# EasyEDA Pro project pcb.eprj, board PCB
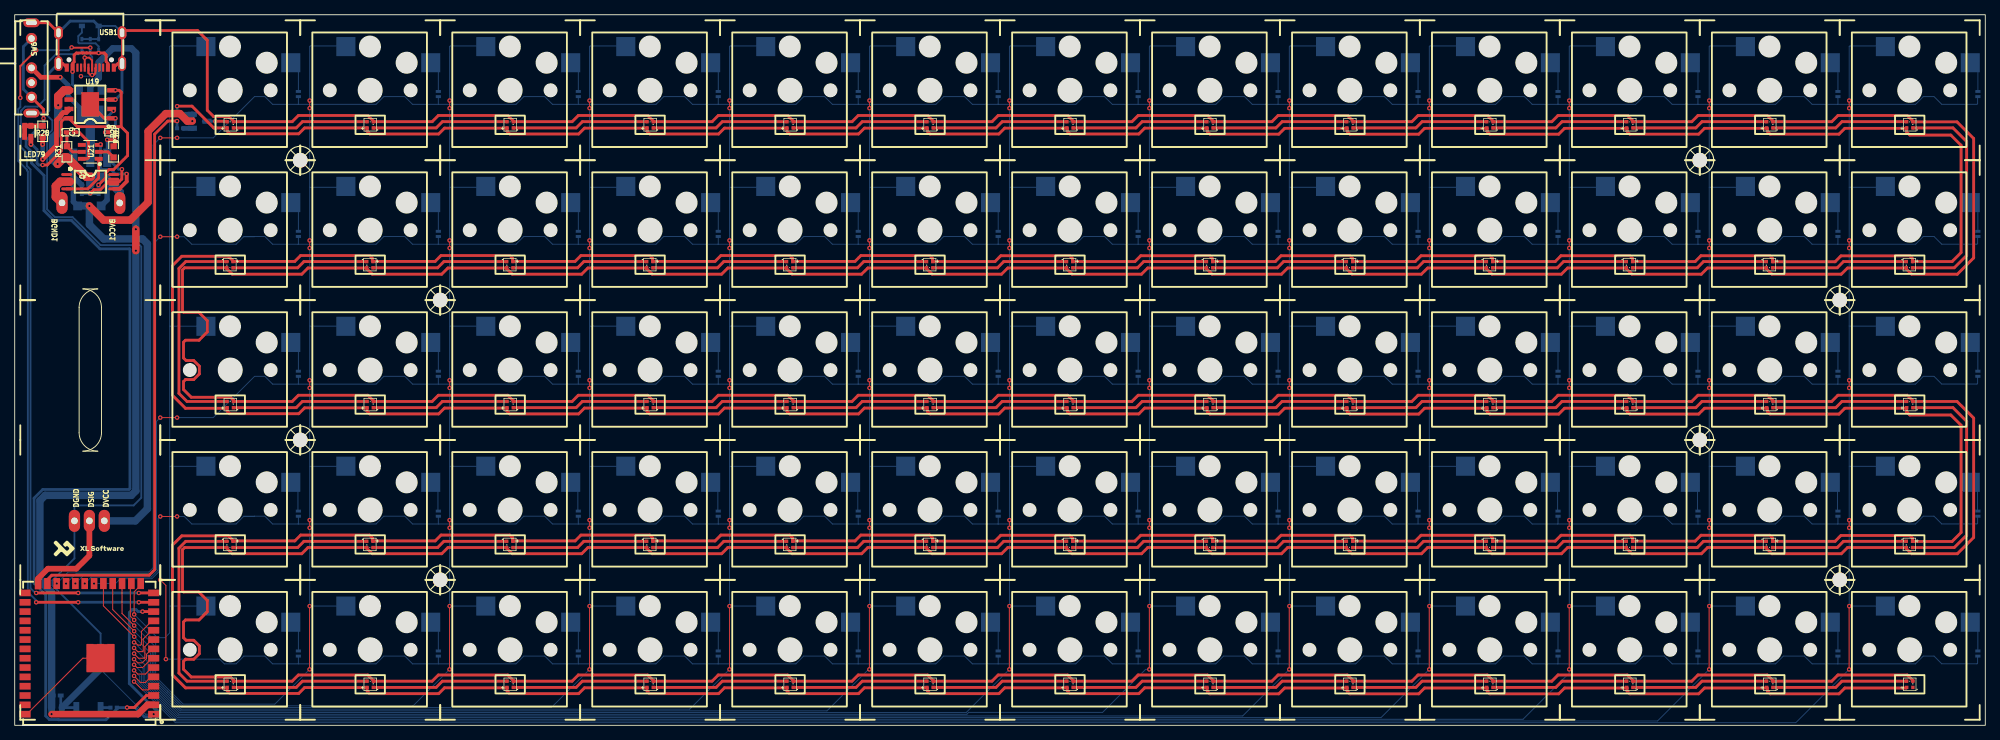
[diagram p6: board, top side]
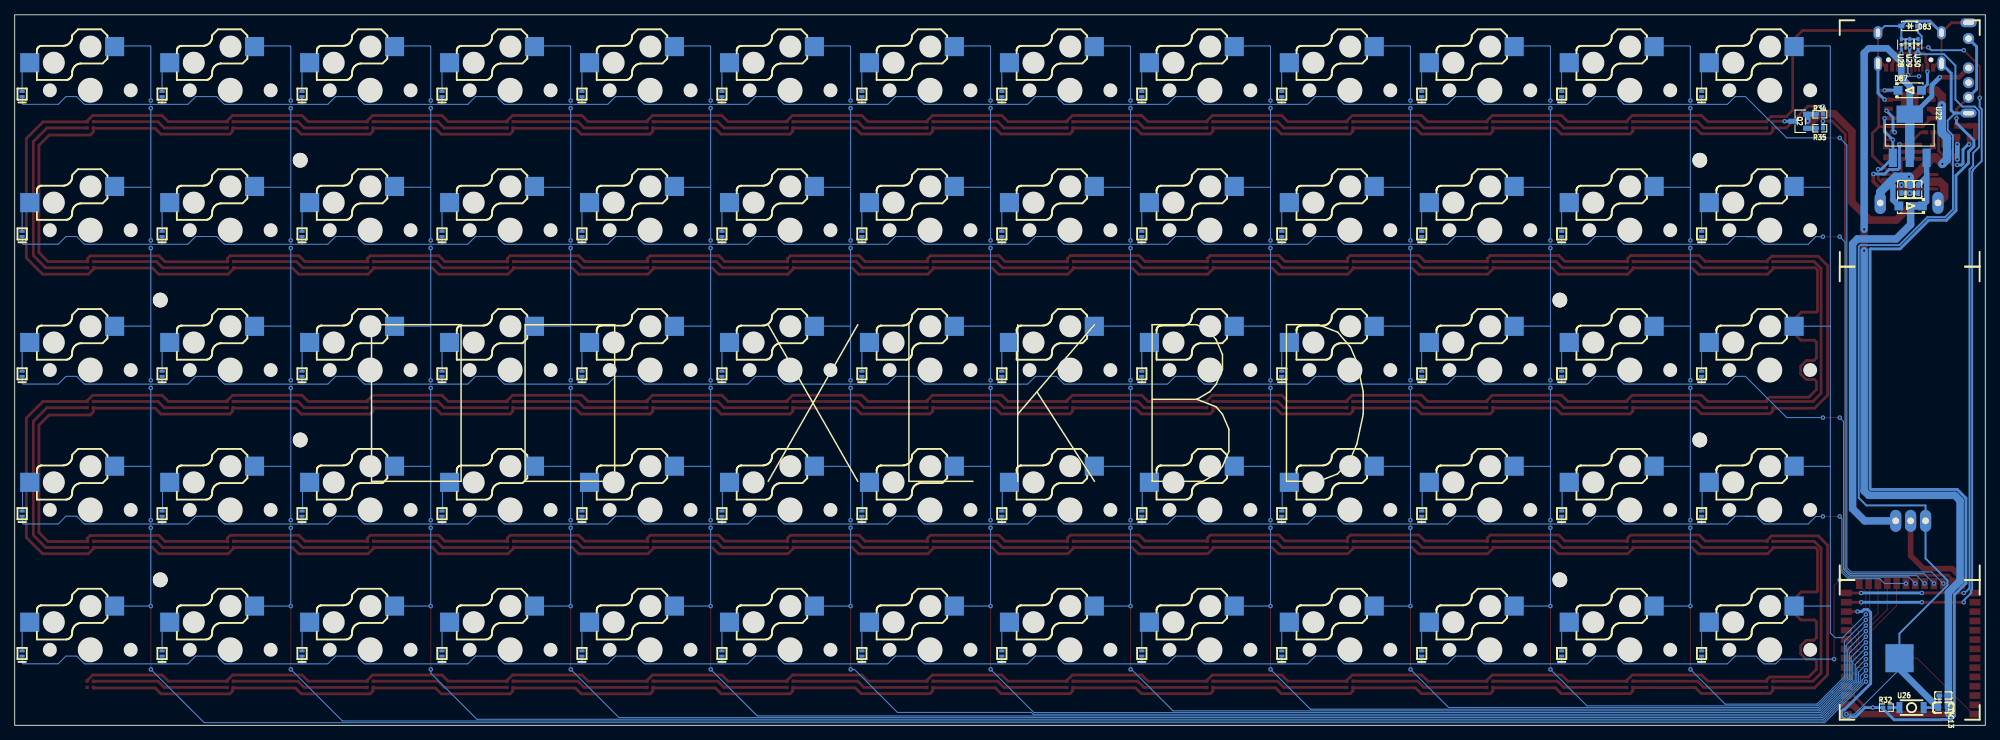
[diagram p7: board, bottom side, seen from below]

Outline 268.22 x 96.77 mm; copper layers: Top Layer, Bottom Layer. Coordinates in mm from the lower left corner of the outline.
Outline path: rectangle 0,96.77 268.22,0
Stack: Top Layer 0.035mm / Dielectric1 1.51mm FR4 er 4.5 / Bottom Layer 0.035mm

## Design rules (mm)
template: JLCPCB Capability(Two Layers Board)
spacing copperThickness1oz (default): track to track 0.102, other pairs 0.152 to 0.3
spacing copperThickness2oz: track to track 0.203, other pairs 0.152 to 0.3
track width copperThickness1oz (default): min 0.127, default 0.254, max 2.54
track width copperThickness2oz: min 0.203, default 0.254, max 2.54
differential pair differentialPair (default): width min 0.127, default 0.254, max 2.54; gap min 0.152, default 0.152
via viaSize (default): diameter min 0.5, default 0.61, max 10; hole min 0.3, default 0.305, max 6.3
net 5V uses copperThickness2oz

## Placement (name value [footprint] x y rotation side)
BGND1  -  [PADX1X]  6.44 71.16 270 bottom
BVCC1  -  [PADX1X]  14.3 71.14 270 bottom
C8  100nF  [C0402]  11.43 73.02 90 bottom
C9  100nF  [C0402]  7.62 80.77 180 top
C10  10uF  [C0402]  10.29 73.02 90 bottom
C11  10uF  [C0402]  9.14 73.02 90 bottom
C13  10uF  [C0603]  5.72 2.41 0 bottom
C14  100nF  [C0402]  5.72 4.06 0 bottom
D1  RB161QS-40T18R  [X2-DFN1006-2_L1.0-W0.6-P0.65-RD]  38.61 85.98 90 bottom
D2  RB161QS-40T18R  [X2-DFN1006-2_L1.0-W0.6-P0.65-RD]  57.66 85.98 90 bottom
D3  RB161QS-40T18R  [X2-DFN1006-2_L1.0-W0.6-P0.65-RD]  76.71 85.98 90 bottom
D4  RB161QS-40T18R  [X2-DFN1006-2_L1.0-W0.6-P0.65-RD]  95.76 85.98 90 bottom
D5  RB161QS-40T18R  [X2-DFN1006-2_L1.0-W0.6-P0.65-RD]  114.81 85.98 90 bottom
D6  RB161QS-40T18R  [X2-DFN1006-2_L1.0-W0.6-P0.65-RD]  133.86 85.98 90 bottom
D7  RB161QS-40T18R  [X2-DFN1006-2_L1.0-W0.6-P0.65-RD]  152.91 85.98 90 bottom
D8  RB161QS-40T18R  [X2-DFN1006-2_L1.0-W0.6-P0.65-RD]  171.96 85.98 90 bottom
D9  RB161QS-40T18R  [X2-DFN1006-2_L1.0-W0.6-P0.65-RD]  191.01 85.98 90 bottom
D10  RB161QS-40T18R  [X2-DFN1006-2_L1.0-W0.6-P0.65-RD]  210.06 85.98 90 bottom
D11  RB161QS-40T18R  [X2-DFN1006-2_L1.0-W0.6-P0.65-RD]  229.11 85.98 90 bottom
D12  RB161QS-40T18R  [X2-DFN1006-2_L1.0-W0.6-P0.65-RD]  248.16 85.98 90 bottom
D13  RB161QS-40T18R  [X2-DFN1006-2_L1.0-W0.6-P0.65-RD]  267.21 85.98 90 bottom
D14  RB161QS-40T18R  [X2-DFN1006-2_L1.0-W0.6-P0.65-RD]  38.61 66.93 90 bottom
D15  RB161QS-40T18R  [X2-DFN1006-2_L1.0-W0.6-P0.65-RD]  57.66 66.93 90 bottom
D16  RB161QS-40T18R  [X2-DFN1006-2_L1.0-W0.6-P0.65-RD]  76.71 66.93 90 bottom
D17  RB161QS-40T18R  [X2-DFN1006-2_L1.0-W0.6-P0.65-RD]  95.76 66.93 90 bottom
D18  RB161QS-40T18R  [X2-DFN1006-2_L1.0-W0.6-P0.65-RD]  114.81 66.93 90 bottom
D19  RB161QS-40T18R  [X2-DFN1006-2_L1.0-W0.6-P0.65-RD]  133.86 66.93 90 bottom
D20  RB161QS-40T18R  [X2-DFN1006-2_L1.0-W0.6-P0.65-RD]  152.91 66.93 90 bottom
D21  RB161QS-40T18R  [X2-DFN1006-2_L1.0-W0.6-P0.65-RD]  171.96 66.93 90 bottom
D22  RB161QS-40T18R  [X2-DFN1006-2_L1.0-W0.6-P0.65-RD]  191.01 66.93 90 bottom
D23  RB161QS-40T18R  [X2-DFN1006-2_L1.0-W0.6-P0.65-RD]  210.06 66.93 90 bottom
D24  RB161QS-40T18R  [X2-DFN1006-2_L1.0-W0.6-P0.65-RD]  229.11 66.93 90 bottom
D25  RB161QS-40T18R  [X2-DFN1006-2_L1.0-W0.6-P0.65-RD]  248.16 66.93 90 bottom
D26  RB161QS-40T18R  [X2-DFN1006-2_L1.0-W0.6-P0.65-RD]  267.21 66.93 90 bottom
D27  RB161QS-40T18R  [X2-DFN1006-2_L1.0-W0.6-P0.65-RD]  38.61 47.88 90 bottom
D28  RB161QS-40T18R  [X2-DFN1006-2_L1.0-W0.6-P0.65-RD]  57.66 47.88 90 bottom
D29  RB161QS-40T18R  [X2-DFN1006-2_L1.0-W0.6-P0.65-RD]  76.71 47.88 90 bottom
D30  RB161QS-40T18R  [X2-DFN1006-2_L1.0-W0.6-P0.65-RD]  95.76 47.88 90 bottom
D31  RB161QS-40T18R  [X2-DFN1006-2_L1.0-W0.6-P0.65-RD]  114.81 47.88 90 bottom
D32  RB161QS-40T18R  [X2-DFN1006-2_L1.0-W0.6-P0.65-RD]  133.86 47.88 90 bottom
D33  RB161QS-40T18R  [X2-DFN1006-2_L1.0-W0.6-P0.65-RD]  152.91 47.88 90 bottom
D34  RB161QS-40T18R  [X2-DFN1006-2_L1.0-W0.6-P0.65-RD]  171.96 47.88 90 bottom
D35  RB161QS-40T18R  [X2-DFN1006-2_L1.0-W0.6-P0.65-RD]  191.01 47.88 90 bottom
D36  RB161QS-40T18R  [X2-DFN1006-2_L1.0-W0.6-P0.65-RD]  210.06 47.88 90 bottom
D37  RB161QS-40T18R  [X2-DFN1006-2_L1.0-W0.6-P0.65-RD]  229.11 47.88 90 bottom
D38  RB161QS-40T18R  [X2-DFN1006-2_L1.0-W0.6-P0.65-RD]  248.16 47.88 90 bottom
D39  RB161QS-40T18R  [X2-DFN1006-2_L1.0-W0.6-P0.65-RD]  267.21 47.88 90 bottom
D53  RB161QS-40T18R  [X2-DFN1006-2_L1.0-W0.6-P0.65-RD]  38.61 28.83 90 bottom
D54  RB161QS-40T18R  [X2-DFN1006-2_L1.0-W0.6-P0.65-RD]  57.66 28.83 90 bottom
D55  RB161QS-40T18R  [X2-DFN1006-2_L1.0-W0.6-P0.65-RD]  76.71 28.83 90 bottom
D56  RB161QS-40T18R  [X2-DFN1006-2_L1.0-W0.6-P0.65-RD]  95.76 28.83 90 bottom
D57  RB161QS-40T18R  [X2-DFN1006-2_L1.0-W0.6-P0.65-RD]  114.81 28.83 90 bottom
D58  RB161QS-40T18R  [X2-DFN1006-2_L1.0-W0.6-P0.65-RD]  133.86 28.83 90 bottom
D59  RB161QS-40T18R  [X2-DFN1006-2_L1.0-W0.6-P0.65-RD]  152.91 28.83 90 bottom
D60  RB161QS-40T18R  [X2-DFN1006-2_L1.0-W0.6-P0.65-RD]  171.96 28.83 90 bottom
D61  RB161QS-40T18R  [X2-DFN1006-2_L1.0-W0.6-P0.65-RD]  191.01 28.83 90 bottom
D62  RB161QS-40T18R  [X2-DFN1006-2_L1.0-W0.6-P0.65-RD]  210.06 28.83 90 bottom
D63  RB161QS-40T18R  [X2-DFN1006-2_L1.0-W0.6-P0.65-RD]  229.11 28.83 90 bottom
D64  RB161QS-40T18R  [X2-DFN1006-2_L1.0-W0.6-P0.65-RD]  248.16 28.83 90 bottom
D65  RB161QS-40T18R  [X2-DFN1006-2_L1.0-W0.6-P0.65-RD]  267.21 28.83 90 bottom
D66  RB161QS-40T18R  [X2-DFN1006-2_L1.0-W0.6-P0.65-RD]  38.61 9.78 90 bottom
D67  RB161QS-40T18R  [X2-DFN1006-2_L1.0-W0.6-P0.65-RD]  57.66 9.78 90 bottom
D68  RB161QS-40T18R  [X2-DFN1006-2_L1.0-W0.6-P0.65-RD]  76.71 9.78 90 bottom
D69  RB161QS-40T18R  [X2-DFN1006-2_L1.0-W0.6-P0.65-RD]  95.76 9.78 90 bottom
D70  RB161QS-40T18R  [X2-DFN1006-2_L1.0-W0.6-P0.65-RD]  114.81 9.78 90 bottom
D71  RB161QS-40T18R  [X2-DFN1006-2_L1.0-W0.6-P0.65-RD]  133.86 9.78 90 bottom
D72  RB161QS-40T18R  [X2-DFN1006-2_L1.0-W0.6-P0.65-RD]  152.91 9.78 90 bottom
D73  RB161QS-40T18R  [X2-DFN1006-2_L1.0-W0.6-P0.65-RD]  171.96 9.78 90 bottom
D74  RB161QS-40T18R  [X2-DFN1006-2_L1.0-W0.6-P0.65-RD]  191.01 9.78 90 bottom
D75  RB161QS-40T18R  [X2-DFN1006-2_L1.0-W0.6-P0.65-RD]  210.06 9.78 90 bottom
D76  RB161QS-40T18R  [X2-DFN1006-2_L1.0-W0.6-P0.65-RD]  229.11 9.78 90 bottom
D77  RB161QS-40T18R  [X2-DFN1006-2_L1.0-W0.6-P0.65-RD]  248.16 9.78 90 bottom
D78  RB161QS-40T18R  [X2-DFN1006-2_L1.0-W0.6-P0.65-RD]  267.21 9.78 90 bottom
D82  1N4007 A7  [SOD-123FL_L2.8-W1.8-LS3.7-RD]  10.16 70.74 0 bottom
D83  BAT760-7  [SOD-323_L1.7-W1.3-LS2.6-RD]  10.29 95.25 0 bottom
D87  1N4007 A7  [SOD-123FL_L2.8-W1.8-LS3.7-RD]  10.29 86.49 180 bottom
DGND  -  [PADX1X]  8.13 27.85 90 top
DSIG  -  [PADX1X]  10.16 27.85 90 top
DVCC  -  [PADX1X]  12.2 27.85 90 top
LED1  XL-1010RGBC-WS2812B  [LED-SMD_4P-L1.0-W1.0-TL_XL-1010RGBC-WS2812B]  257.94 5.59 180 top
LED2  XL-1010RGBC-WS2812B  [LED-SMD_4P-L1.0-W1.0-TL_XL-1010RGBC-WS2812B]  238.89 5.59 180 top
LED3  XL-1010RGBC-WS2812B  [LED-SMD_4P-L1.0-W1.0-TL_XL-1010RGBC-WS2812B]  219.84 5.59 180 top
LED4  XL-1010RGBC-WS2812B  [LED-SMD_4P-L1.0-W1.0-TL_XL-1010RGBC-WS2812B]  200.79 5.59 180 top
LED5  XL-1010RGBC-WS2812B  [LED-SMD_4P-L1.0-W1.0-TL_XL-1010RGBC-WS2812B]  181.74 5.59 180 top
LED6  XL-1010RGBC-WS2812B  [LED-SMD_4P-L1.0-W1.0-TL_XL-1010RGBC-WS2812B]  162.69 5.59 180 top
LED7  XL-1010RGBC-WS2812B  [LED-SMD_4P-L1.0-W1.0-TL_XL-1010RGBC-WS2812B]  143.64 5.59 180 top
LED8  XL-1010RGBC-WS2812B  [LED-SMD_4P-L1.0-W1.0-TL_XL-1010RGBC-WS2812B]  124.59 5.59 180 top
LED9  XL-1010RGBC-WS2812B  [LED-SMD_4P-L1.0-W1.0-TL_XL-1010RGBC-WS2812B]  105.54 5.59 180 top
LED10  XL-1010RGBC-WS2812B  [LED-SMD_4P-L1.0-W1.0-TL_XL-1010RGBC-WS2812B]  86.49 5.59 180 top
LED11  XL-1010RGBC-WS2812B  [LED-SMD_4P-L1.0-W1.0-TL_XL-1010RGBC-WS2812B]  67.44 5.59 180 top
LED12  XL-1010RGBC-WS2812B  [LED-SMD_4P-L1.0-W1.0-TL_XL-1010RGBC-WS2812B]  48.39 5.59 180 top
LED13  XL-1010RGBC-WS2812B  [LED-SMD_4P-L1.0-W1.0-TL_XL-1010RGBC-WS2812B]  29.34 5.59 180 top
LED14  XL-1010RGBC-WS2812B  [LED-SMD_4P-L1.0-W1.0-TL_XL-1010RGBC-WS2812B]  29.29 24.64 0 top
LED15  XL-1010RGBC-WS2812B  [LED-SMD_4P-L1.0-W1.0-TL_XL-1010RGBC-WS2812B]  48.34 24.64 0 top
LED16  XL-1010RGBC-WS2812B  [LED-SMD_4P-L1.0-W1.0-TL_XL-1010RGBC-WS2812B]  67.39 24.64 0 top
LED17  XL-1010RGBC-WS2812B  [LED-SMD_4P-L1.0-W1.0-TL_XL-1010RGBC-WS2812B]  86.44 24.64 0 top
LED18  XL-1010RGBC-WS2812B  [LED-SMD_4P-L1.0-W1.0-TL_XL-1010RGBC-WS2812B]  105.49 24.64 0 top
LED19  XL-1010RGBC-WS2812B  [LED-SMD_4P-L1.0-W1.0-TL_XL-1010RGBC-WS2812B]  124.54 24.64 0 top
LED20  XL-1010RGBC-WS2812B  [LED-SMD_4P-L1.0-W1.0-TL_XL-1010RGBC-WS2812B]  143.59 24.64 0 top
LED21  XL-1010RGBC-WS2812B  [LED-SMD_4P-L1.0-W1.0-TL_XL-1010RGBC-WS2812B]  162.64 24.64 0 top
LED22  XL-1010RGBC-WS2812B  [LED-SMD_4P-L1.0-W1.0-TL_XL-1010RGBC-WS2812B]  181.69 24.64 0 top
LED23  XL-1010RGBC-WS2812B  [LED-SMD_4P-L1.0-W1.0-TL_XL-1010RGBC-WS2812B]  200.74 24.64 0 top
LED24  XL-1010RGBC-WS2812B  [LED-SMD_4P-L1.0-W1.0-TL_XL-1010RGBC-WS2812B]  219.79 24.64 0 top
LED25  XL-1010RGBC-WS2812B  [LED-SMD_4P-L1.0-W1.0-TL_XL-1010RGBC-WS2812B]  238.84 24.64 0 top
LED26  XL-1010RGBC-WS2812B  [LED-SMD_4P-L1.0-W1.0-TL_XL-1010RGBC-WS2812B]  257.89 24.64 0 top
LED27  XL-1010RGBC-WS2812B  [LED-SMD_4P-L1.0-W1.0-TL_XL-1010RGBC-WS2812B]  257.94 43.69 180 top
LED28  XL-1010RGBC-WS2812B  [LED-SMD_4P-L1.0-W1.0-TL_XL-1010RGBC-WS2812B]  238.89 43.69 180 top
LED29  XL-1010RGBC-WS2812B  [LED-SMD_4P-L1.0-W1.0-TL_XL-1010RGBC-WS2812B]  219.84 43.69 180 top
LED30  XL-1010RGBC-WS2812B  [LED-SMD_4P-L1.0-W1.0-TL_XL-1010RGBC-WS2812B]  200.79 43.69 180 top
LED31  XL-1010RGBC-WS2812B  [LED-SMD_4P-L1.0-W1.0-TL_XL-1010RGBC-WS2812B]  181.74 43.69 180 top
LED32  XL-1010RGBC-WS2812B  [LED-SMD_4P-L1.0-W1.0-TL_XL-1010RGBC-WS2812B]  162.69 43.69 180 top
LED33  XL-1010RGBC-WS2812B  [LED-SMD_4P-L1.0-W1.0-TL_XL-1010RGBC-WS2812B]  143.64 43.69 180 top
LED34  XL-1010RGBC-WS2812B  [LED-SMD_4P-L1.0-W1.0-TL_XL-1010RGBC-WS2812B]  124.59 43.69 180 top
LED35  XL-1010RGBC-WS2812B  [LED-SMD_4P-L1.0-W1.0-TL_XL-1010RGBC-WS2812B]  105.54 43.69 180 top
LED36  XL-1010RGBC-WS2812B  [LED-SMD_4P-L1.0-W1.0-TL_XL-1010RGBC-WS2812B]  86.49 43.69 180 top
LED37  XL-1010RGBC-WS2812B  [LED-SMD_4P-L1.0-W1.0-TL_XL-1010RGBC-WS2812B]  67.44 43.69 180 top
LED38  XL-1010RGBC-WS2812B  [LED-SMD_4P-L1.0-W1.0-TL_XL-1010RGBC-WS2812B]  48.39 43.69 180 top
LED39  XL-1010RGBC-WS2812B  [LED-SMD_4P-L1.0-W1.0-TL_XL-1010RGBC-WS2812B]  29.34 43.69 180 top
LED53  XL-1010RGBC-WS2812B  [LED-SMD_4P-L1.0-W1.0-TL_XL-1010RGBC-WS2812B]  29.29 62.74 0 top
LED54  XL-1010RGBC-WS2812B  [LED-SMD_4P-L1.0-W1.0-TL_XL-1010RGBC-WS2812B]  48.34 62.74 0 top
LED55  XL-1010RGBC-WS2812B  [LED-SMD_4P-L1.0-W1.0-TL_XL-1010RGBC-WS2812B]  67.39 62.74 0 top
LED56  XL-1010RGBC-WS2812B  [LED-SMD_4P-L1.0-W1.0-TL_XL-1010RGBC-WS2812B]  86.44 62.74 0 top
LED57  XL-1010RGBC-WS2812B  [LED-SMD_4P-L1.0-W1.0-TL_XL-1010RGBC-WS2812B]  105.49 62.74 0 top
LED58  XL-1010RGBC-WS2812B  [LED-SMD_4P-L1.0-W1.0-TL_XL-1010RGBC-WS2812B]  124.54 62.74 0 top
LED59  XL-1010RGBC-WS2812B  [LED-SMD_4P-L1.0-W1.0-TL_XL-1010RGBC-WS2812B]  143.59 62.74 0 top
LED60  XL-1010RGBC-WS2812B  [LED-SMD_4P-L1.0-W1.0-TL_XL-1010RGBC-WS2812B]  162.64 62.74 0 top
LED61  XL-1010RGBC-WS2812B  [LED-SMD_4P-L1.0-W1.0-TL_XL-1010RGBC-WS2812B]  181.69 62.74 0 top
LED62  XL-1010RGBC-WS2812B  [LED-SMD_4P-L1.0-W1.0-TL_XL-1010RGBC-WS2812B]  200.74 62.74 0 top
LED63  XL-1010RGBC-WS2812B  [LED-SMD_4P-L1.0-W1.0-TL_XL-1010RGBC-WS2812B]  219.79 62.74 0 top
LED64  XL-1010RGBC-WS2812B  [LED-SMD_4P-L1.0-W1.0-TL_XL-1010RGBC-WS2812B]  238.84 62.74 0 top
LED65  XL-1010RGBC-WS2812B  [LED-SMD_4P-L1.0-W1.0-TL_XL-1010RGBC-WS2812B]  257.89 62.74 0 top
LED66  XL-1010RGBC-WS2812B  [LED-SMD_4P-L1.0-W1.0-TL_XL-1010RGBC-WS2812B]  257.94 81.79 180 top
LED67  XL-1010RGBC-WS2812B  [LED-SMD_4P-L1.0-W1.0-TL_XL-1010RGBC-WS2812B]  238.89 81.79 180 top
LED68  XL-1010RGBC-WS2812B  [LED-SMD_4P-L1.0-W1.0-TL_XL-1010RGBC-WS2812B]  219.84 81.79 180 top
LED69  XL-1010RGBC-WS2812B  [LED-SMD_4P-L1.0-W1.0-TL_XL-1010RGBC-WS2812B]  200.79 81.79 180 top
LED70  XL-1010RGBC-WS2812B  [LED-SMD_4P-L1.0-W1.0-TL_XL-1010RGBC-WS2812B]  181.74 81.79 180 top
LED71  XL-1010RGBC-WS2812B  [LED-SMD_4P-L1.0-W1.0-TL_XL-1010RGBC-WS2812B]  162.69 81.79 180 top
LED72  XL-1010RGBC-WS2812B  [LED-SMD_4P-L1.0-W1.0-TL_XL-1010RGBC-WS2812B]  143.64 81.79 180 top
LED73  XL-1010RGBC-WS2812B  [LED-SMD_4P-L1.0-W1.0-TL_XL-1010RGBC-WS2812B]  124.59 81.79 180 top
LED74  XL-1010RGBC-WS2812B  [LED-SMD_4P-L1.0-W1.0-TL_XL-1010RGBC-WS2812B]  105.54 81.79 180 top
LED75  XL-1010RGBC-WS2812B  [LED-SMD_4P-L1.0-W1.0-TL_XL-1010RGBC-WS2812B]  86.49 81.79 180 top
LED76  XL-1010RGBC-WS2812B  [LED-SMD_4P-L1.0-W1.0-TL_XL-1010RGBC-WS2812B]  67.44 81.79 180 top
LED77  XL-1010RGBC-WS2812B  [LED-SMD_4P-L1.0-W1.0-TL_XL-1010RGBC-WS2812B]  48.39 81.79 180 top
LED78  XL-1010RGBC-WS2812B  [LED-SMD_4P-L1.0-W1.0-TL_XL-1010RGBC-WS2812B]  29.34 81.79 180 top
LED79  XL-1615RGBC-RF  [LED-ARRAY-SMD_4P-L1.6-W1.5-BR_XL-1615RGBC-RF]  1.78 80.9 270 top
NOREF  -  [Pad_e6664]  11.69 9.14 0 top
Q1  FS8205A  [TSSOP-8_L4.4-W3.0-P0.65-LS6.4-BL-2]  10.29 74.04 270 top
Q2  S8550  [SOT-23-3_L2.9-W1.3-P1.90-LS2.4-BR]  25.18 82.27 180 bottom
R28  1kΩ  [R0603]  3.81 80.9 90 top
R29  1.2kΩ  [R0402]  13.21 80.77 180 top
R30  1kΩ  [R0603]  13.46 78.1 90 top
R31  1kΩ  [R0603]  7.11 78.1 270 top
R32  22Ω  [R0402]  13.47 2.41 0 bottom
R34  1kΩ  [R0402]  22.53 83.22 0 bottom
R35  1kΩ  [R0402]  22.53 81.31 0 bottom
SCREW11  -  [Screw-Hole-M2]  38.86 76.96 0 top
SCREW11#2  -  [Screw-Hole-M2]  57.91 57.91 0 top
SCREW11#3  -  [Screw-Hole-M2]  38.86 38.86 0 top
SCREW11#4  -  [Screw-Hole-M2]  57.91 19.81 0 top
SCREW17  -  [Screw-Hole-M2]  229.36 76.96 0 top
SCREW22  -  [Screw-Hole-M2]  229.36 38.86 0 top
SCREW23  -  [Screw-Hole-M2]  248.41 57.91 0 top
SCREW24  -  [Screw-Hole-M2]  248.41 19.81 0 top
SW6  SK-13D07-G030  [SW-TH_DEALON_SK-13D07-G3]  2.29 89.53 270 top
SWCH1  CPG135001S30  [CONN-SMD_HOTPLUGPAKAGE__C9900010116]  19.81 96.01 0 top
SWCH2  CPG135001S30  [CONN-SMD_HOTPLUGPAKAGE__C9900010116]  38.86 96.01 0 top
SWCH3  CPG135001S30  [CONN-SMD_HOTPLUGPAKAGE__C9900010116]  57.91 96.01 0 top
SWCH4  CPG135001S30  [CONN-SMD_HOTPLUGPAKAGE__C9900010116]  76.96 96.01 0 top
SWCH5  CPG135001S30  [CONN-SMD_HOTPLUGPAKAGE__C9900010116]  96.01 96.01 0 top
SWCH6  CPG135001S30  [CONN-SMD_HOTPLUGPAKAGE__C9900010116]  115.06 96.01 0 top
SWCH7  CPG135001S30  [CONN-SMD_HOTPLUGPAKAGE__C9900010116]  134.11 96.01 0 top
SWCH8  CPG135001S30  [CONN-SMD_HOTPLUGPAKAGE__C9900010116]  153.16 96.01 0 top
SWCH9  CPG135001S30  [CONN-SMD_HOTPLUGPAKAGE__C9900010116]  172.21 96.01 0 top
SWCH10  CPG135001S30  [CONN-SMD_HOTPLUGPAKAGE__C9900010116]  191.26 96.01 0 top
SWCH11  CPG135001S30  [CONN-SMD_HOTPLUGPAKAGE__C9900010116]  210.31 96.01 0 top
SWCH12  CPG135001S30  [CONN-SMD_HOTPLUGPAKAGE__C9900010116]  229.36 96.01 0 top
SWCH13  CPG135001S30  [CONN-SMD_HOTPLUGPAKAGE__C9900010116]  248.41 96.01 0 top
SWCH14  CPG135001S30  [CONN-SMD_HOTPLUGPAKAGE__C9900010116]  19.81 76.96 0 top
SWCH15  CPG135001S30  [CONN-SMD_HOTPLUGPAKAGE__C9900010116]  38.86 76.96 0 top
SWCH16  CPG135001S30  [CONN-SMD_HOTPLUGPAKAGE__C9900010116]  57.91 76.96 0 top
SWCH17  CPG135001S30  [CONN-SMD_HOTPLUGPAKAGE__C9900010116]  76.96 76.96 0 top
SWCH18  CPG135001S30  [CONN-SMD_HOTPLUGPAKAGE__C9900010116]  96.01 76.96 0 top
SWCH19  CPG135001S30  [CONN-SMD_HOTPLUGPAKAGE__C9900010116]  115.06 76.96 0 top
SWCH20  CPG135001S30  [CONN-SMD_HOTPLUGPAKAGE__C9900010116]  134.11 76.96 0 top
SWCH21  CPG135001S30  [CONN-SMD_HOTPLUGPAKAGE__C9900010116]  153.16 76.96 0 top
SWCH22  CPG135001S30  [CONN-SMD_HOTPLUGPAKAGE__C9900010116]  172.21 76.96 0 top
SWCH23  CPG135001S30  [CONN-SMD_HOTPLUGPAKAGE__C9900010116]  191.26 76.96 0 top
SWCH24  CPG135001S30  [CONN-SMD_HOTPLUGPAKAGE__C9900010116]  210.31 76.96 0 top
SWCH25  CPG135001S30  [CONN-SMD_HOTPLUGPAKAGE__C9900010116]  229.36 76.96 0 top
SWCH26  CPG135001S30  [CONN-SMD_HOTPLUGPAKAGE__C9900010116]  248.41 76.96 0 top
SWCH27  CPG135001S30  [CONN-SMD_HOTPLUGPAKAGE__C9900010116]  19.81 57.91 0 top
SWCH28  CPG135001S30  [CONN-SMD_HOTPLUGPAKAGE__C9900010116]  38.86 57.91 0 top
SWCH29  CPG135001S30  [CONN-SMD_HOTPLUGPAKAGE__C9900010116]  57.91 57.91 0 top
SWCH30  CPG135001S30  [CONN-SMD_HOTPLUGPAKAGE__C9900010116]  76.96 57.91 0 top
SWCH31  CPG135001S30  [CONN-SMD_HOTPLUGPAKAGE__C9900010116]  96.01 57.91 0 top
SWCH32  CPG135001S30  [CONN-SMD_HOTPLUGPAKAGE__C9900010116]  115.06 57.91 0 top
SWCH33  CPG135001S30  [CONN-SMD_HOTPLUGPAKAGE__C9900010116]  134.11 57.91 0 top
SWCH34  CPG135001S30  [CONN-SMD_HOTPLUGPAKAGE__C9900010116]  153.16 57.91 0 top
SWCH35  CPG135001S30  [CONN-SMD_HOTPLUGPAKAGE__C9900010116]  172.21 57.91 0 top
SWCH36  CPG135001S30  [CONN-SMD_HOTPLUGPAKAGE__C9900010116]  191.26 57.91 0 top
SWCH37  CPG135001S30  [CONN-SMD_HOTPLUGPAKAGE__C9900010116]  210.31 57.91 0 top
SWCH38  CPG135001S30  [CONN-SMD_HOTPLUGPAKAGE__C9900010116]  229.36 57.91 0 top
SWCH39  CPG135001S30  [CONN-SMD_HOTPLUGPAKAGE__C9900010116]  248.41 57.91 0 top
SWCH53  CPG135001S30  [CONN-SMD_HOTPLUGPAKAGE__C9900010116]  19.81 38.86 0 top
SWCH54  CPG135001S30  [CONN-SMD_HOTPLUGPAKAGE__C9900010116]  38.86 38.86 0 top
SWCH55  CPG135001S30  [CONN-SMD_HOTPLUGPAKAGE__C9900010116]  57.91 38.86 0 top
SWCH56  CPG135001S30  [CONN-SMD_HOTPLUGPAKAGE__C9900010116]  76.96 38.86 0 top
SWCH57  CPG135001S30  [CONN-SMD_HOTPLUGPAKAGE__C9900010116]  96.01 38.86 0 top
SWCH58  CPG135001S30  [CONN-SMD_HOTPLUGPAKAGE__C9900010116]  115.06 38.86 0 top
SWCH59  CPG135001S30  [CONN-SMD_HOTPLUGPAKAGE__C9900010116]  134.11 38.86 0 top
SWCH60  CPG135001S30  [CONN-SMD_HOTPLUGPAKAGE__C9900010116]  153.16 38.86 0 top
SWCH61  CPG135001S30  [CONN-SMD_HOTPLUGPAKAGE__C9900010116]  172.21 38.86 0 top
SWCH62  CPG135001S30  [CONN-SMD_HOTPLUGPAKAGE__C9900010116]  191.26 38.86 0 top
SWCH63  CPG135001S30  [CONN-SMD_HOTPLUGPAKAGE__C9900010116]  210.31 38.86 0 top
SWCH64  CPG135001S30  [CONN-SMD_HOTPLUGPAKAGE__C9900010116]  229.36 38.86 0 top
SWCH65  CPG135001S30  [CONN-SMD_HOTPLUGPAKAGE__C9900010116]  248.41 38.86 0 top
SWCH66  CPG135001S30  [CONN-SMD_HOTPLUGPAKAGE__C9900010116]  19.81 19.81 0 top
SWCH67  CPG135001S30  [CONN-SMD_HOTPLUGPAKAGE__C9900010116]  38.86 19.81 0 top
SWCH68  CPG135001S30  [CONN-SMD_HOTPLUGPAKAGE__C9900010116]  57.91 19.81 0 top
SWCH69  CPG135001S30  [CONN-SMD_HOTPLUGPAKAGE__C9900010116]  76.96 19.81 0 top
SWCH70  CPG135001S30  [CONN-SMD_HOTPLUGPAKAGE__C9900010116]  96.01 19.81 0 top
SWCH71  CPG135001S30  [CONN-SMD_HOTPLUGPAKAGE__C9900010116]  115.06 19.81 0 top
SWCH72  CPG135001S30  [CONN-SMD_HOTPLUGPAKAGE__C9900010116]  134.11 19.81 0 top
SWCH73  CPG135001S30  [CONN-SMD_HOTPLUGPAKAGE__C9900010116]  153.16 19.81 0 top
SWCH74  CPG135001S30  [CONN-SMD_HOTPLUGPAKAGE__C9900010116]  172.21 19.81 0 top
SWCH75  CPG135001S30  [CONN-SMD_HOTPLUGPAKAGE__C9900010116]  191.26 19.81 0 top
SWCH76  CPG135001S30  [CONN-SMD_HOTPLUGPAKAGE__C9900010116]  210.31 19.81 0 top
SWCH77  CPG135001S30  [CONN-SMD_HOTPLUGPAKAGE__C9900010116]  229.36 19.81 0 top
SWCH78  CPG135001S30  [CONN-SMD_HOTPLUGPAKAGE__C9900010116]  248.41 19.81 0 top
U19  TP4056  [ESOP-8_L4.9-W3.9-P1.27-LS6.0-BL-EP]  10.29 84.58 90 top
U21  DW01A  [SOT-23-6_L2.9-W1.6-P0.95-LS2.8-BL]  10.29 78.1 90 top
U22  AMS1117  [SOT-223-3_L6.5-W3.5-P3.05-LS7.0]  10.29 80.26 270 bottom
U26  TS2306A 200gf 002  [SW-SMD_L3.0-W2.0-LS3.5]  10.04 2.41 180 bottom
U27  ESP32-S3-WROOM-1U-N16R8  [WIRELM-SMD_ESP32-S3-WROOM-1U]  10.16 10.41 180 top
U28  LESD5D5.0CT1G  [SOD-523_L1.2-W0.8-LS1.6-BI]  11.43 92.71 270 bottom
U29  LESD5D5.0CT1G  [SOD-523_L1.2-W0.8-LS1.6-BI]  10.29 92.71 270 bottom
U30  LESD5D5.0CT1G  [SOD-523_L1.2-W0.8-LS1.6-BI]  9.14 92.71 270 bottom
USB1  TYPE-C 16PIN 2MD(073)  [USB-C-SMD_TYPE-C-6PIN-2MD-073]  10.29 91.95 180 top

## Footprints (pads in the part's own frame, mm; a bottom-side part is the same pattern mirrored in y, then rotated)
C0402
  rect 0.79x0.54 smd: 1(-0.545,0) 2(0.545,0)
C0603
  rect 0.8x0.9 smd: 1(-0.7,0) 2(0.7,0)
CONN-SMD_HOTPLUGPAKAGE__C9900010116
  rect 2.6x2.6 smd far side: 1(17.764,-5.769) 2(6.214,-3.569)
ESOP-8_L4.9-W3.9-P1.27-LS6.0-BL-EP
  rect 0.6x1.2 smd: 1(-1.905,-2.909) 2(-0.635,-2.909) 3(0.635,-2.909) 4(1.905,-2.909) 5(1.905,2.909) 6(0.635,2.909) 7(-0.635,2.909) 8(-1.905,2.909)
  rect 3.3x2.4 smd: 9(0,0)
LED-ARRAY-SMD_4P-L1.6-W1.5-BR_XL-1615RGBC-RF
  rect 0.8x0.65 smd: 1(0.75,-0.425) 2(0.75,0.425) 3(-0.75,0.425) 4(-0.75,-0.425)
LED-SMD_4P-L1.0-W1.0-TL_XL-1010RGBC-WS2812B
  rect 0.45x0.45 smd: 1(-0.425,0.424) 2(0.425,0.425) 3(-0.425,-0.425) 4(0.425,-0.425)
Pad_e6664
  rect 3.81x3.81 hole 0.003: 1(0,0)
PADX1X
  rrect 3x1.524 hole 0.914: 1(0,0)
R0402
  rect 0.566x0.54 smd: 1(-0.433,0) 2(0.433,0)
R0603
  rect 0.806x0.864 smd: 1(-0.753,0) 2(0.753,0)
Screw-Hole-M2
  round 2 hole 2: 1(0,0)
SOD-123FL_L2.8-W1.8-LS3.7-RD
  rect 1.2x1.2 smd: 1(-1.6,0) 2(1.6,0)
SOD-323_L1.7-W1.3-LS2.6-RD
  rect 0.83x0.63 smd: 1(-1.14,0) 2(1.14,0)
SOD-523_L1.2-W0.8-LS1.6-BI
  rect 0.6x0.4 smd: 1(-0.75,0) 2(0.75,0)
SOT-23-3_L2.9-W1.3-P1.90-LS2.4-BR
  rect 1.25x0.7 smd: 1(1,-0.95) 2(1,0.95) 3(-1,0)
SOT-23-6_L2.9-W1.6-P0.95-LS2.8-BL
  rect 0.532x1.072 smd: 1(-0.95,-1.149) 2(0,-1.149) 3(0.95,-1.149) 4(0.95,1.149) 5(0,1.149) 6(-0.95,1.149)
SOT-223-3_L6.5-W3.5-P3.05-LS7.0
  rect 2.5x1.1 smd: 1(2.97,-2.3) 2(2.97,0) 3(2.97,2.3)
  rect 2.34x3.6 smd: 4(-2.97,0)
SW-SMD_L3.0-W2.0-LS3.5
  rect 0.8x1.524 smd: 1(-1.651,0) 2(1.651,0)
SW-TH_DEALON_SK-13D07-G3
  round 1.524 hole 0.914: 1(-4,0) 2(0,0) 3(2,0) 4(4,0)
  oval 1.2x2.2 hole 0.6x1.5: 5(6.15,0) 6(-6.15,0)
TSSOP-8_L4.4-W3.0-P0.65-LS6.4-BL-2
  oval 0.4x1.5 smd: 1(-0.975,-3.2) 2(-0.325,-3.2) 3(0.325,-3.2) 4(0.976,-3.2) 5(0.976,3.2) 6(0.325,3.2) 7(-0.325,3.2) 8(-0.975,3.2)
USB-C-SMD_TYPE-C-6PIN-2MD-073
  rect 0.55x1.1 smd: 1(-3.2,2.375) 2(-2.4,2.375) 11(2.4,2.375) 12(3.2,2.375)
  rect 0.3x1.1 smd: 3(-1.75,2.375) 4(-1.25,2.375) 5(-0.75,2.375) 6(-0.25,2.375) 7(0.25,2.375) 8(0.75,2.375) 9(1.25,2.375) 10(1.75,2.375)
  oval 1.1x2 hole 0.6x1.5: 13(-4.325,1.825) 14(4.325,1.825)
  oval 1.2x1.8 hole 0.6x1.2: 13(-4.325,-2.375) 14(4.325,-2.375)
WIRELM-SMD_ESP32-S3-WROOM-1U
  rect 1.5x0.9 smd: 1(-8.75,8.895) 2(-8.75,7.625) 3(-8.75,6.355) 4(-8.75,5.085) 5(-8.75,3.815) 6(-8.75,2.545) 7(-8.75,1.275) 8(-8.75,0.005) 9(-8.75,-1.265) 10(-8.75,-2.535) 11(-8.75,-3.805) 12(-8.75,-5.075) 13(-8.75,-6.345) 14(-8.75,-7.615) 27(8.75,-7.615) 28(8.75,-6.345) 29(8.75,-5.075) 30(8.75,-3.805) 31(8.75,-2.535) 32(8.75,-1.265) 33(8.75,0.005) 34(8.75,1.275) 35(8.75,2.545) 36(8.75,3.815) 37(8.75,5.085) 38(8.75,6.355) 39(8.75,7.625) 40(8.75,8.895)
  rect 0.9x1.5 smd: 15(-6.985,-8.895) 16(-5.715,-8.895) 17(-4.445,-8.895) 18(-3.175,-8.895) 19(-1.905,-8.895) 20(-0.635,-8.895) 21(0.635,-8.895) 22(1.905,-8.895) 23(3.175,-8.895) 24(4.445,-8.895) 25(5.715,-8.895) 26(6.985,-8.865)
  rect 0.9x0.9 smd: 41(-2.9,2.575) 41(-2.9,1.175) 41(-2.9,-0.225) 41(-1.5,2.575) 41(-1.5,1.175) 41(-1.5,-0.225) 41(-0.1,2.575) 41(-0.1,1.175) 41(-0.1,-0.225)
X2-DFN1006-2_L1.0-W0.6-P0.65-RD
  rect 0.4x0.7 smd: 1(-0.35,0) 2(0.35,0)

## Nets
As in the schematic, except:
GND: C8.1 C10.1 C11.1 C13.2 C14.2 D83.2 DGND.1 LED1.3 LED2.3 LED3.3 LED4.3 LED5.3 LED6.3 LED7.3 LED8.3 LED9.3 LED10.3 LED11.3 LED12.3 LED13.3 LED14.3 LED15.3 LED16.3 LED17.3 LED18.3 LED19.3 LED20.3 LED21.3 LED22.3 LED23.3 LED24.3 LED25.3 LED26.3 LED27.3 LED28.3 LED29.3 LED30.3 LED31.3 LED32.3 LED33.3 LED34.3 LED35.3 LED36.3 LED37.3 LED38.3 LED39.3 LED53.3 LED54.3 LED55.3 LED56.3 LED57.3 LED58.3 LED59.3 LED60.3 LED61.3 LED62.3 LED63.3 LED64.3 LED65.3 LED66.3 LED67.3 LED68.3 LED69.3 LED70.3 LED71.3 LED72.3 LED73.3 LED74.3 LED75.3 LED76.3 LED77.3 LED78.3 NOREF.1 Q1.6 Q1.7 R29.1 R30.2 SW6.5 SW6.6 U19.1 U19.3 U19.9 U22.1 U26.2 U27.1 U27.40 U27.41 U28.1 U29.1 U30.1 USB1.1 USB1.12 USB1.13 USB1.14

Pads without a net: LED1 1; Q1 1 8; SCREW11 1; SCREW11#2 1; SCREW11#3 1; SCREW11#4 1; SCREW17 1; SCREW22 1; SCREW23 1; SCREW24 1; SW6 3; U19 6; U21 4; U27 27 28 29 30 31 32 33 34 35 36 37 38 39; USB1 3 4 9 10

## Via types
v1: diameter 0.61, hole 0.305, Top Layer to Bottom Layer, 194 vias

## Routing (per net, layer and track width the routed paths; a pad name or vN(x,y) marks a point on that pad's centre or on a via; arc(x,y) is an arc through that point)
3.3V: length 148.1
  Top Layer w0.635: SW6.2 3.56,88.26 v1(6.19,88.26)
  Top Layer w0.889: 18.92,2.79 18.06,2.79 16.79,1.52 v1(5.02,1.52)
  Top Layer w1.016: v1(16.49,64.64) v1(16.49,67.56)
  Bottom Layer w0.635: 10.29,82.68 7.26,85.7 7.26,87.19 v1(6.19,88.26)
  Bottom Layer w0.889: U22.4 10.29,87.04 11.44,88.19 11.44,90.3 13.34,92.2 15.89,92.2 16.52,91.57 ; C13.1 v1(5.02,1.52)
  Bottom Layer w1.016: v1(16.49,64.64) 16.49,31.93 15.88,31.32 4.15,31.32 3.43,30.6 3.43,19.68 5.02,18.1 C13.1 ; 16.49,91.54 v1(16.49,67.56)
  Bottom Layer w1.27: U22.2 10.29,82.68
5V: length 93.2
  Top Layer w1.016: v1(24.18,82.29) 23.5,82.29 22.48,83.31 20.57,83.31 18.15,80.89 18.15,71.23 15.74,68.82 12.09,68.82 v1(10.16,70.74)
  Bottom Layer w0.635: R34.2 22.96,83.22 Q2.2
  Bottom Layer w0.737: U22.3 7.99,74.73 ; 7.99,74.73 C11.2 ; 7.99,74.73 7.99,71.31 8.57,70.74
  Bottom Layer w0.762: Q2.2 v1(24.18,82.29)
  Bottom Layer w1.016: 8.57,70.74 v1(10.16,70.74) 10.16,68.2 12.12,66.24 17.4,66.24 18.06,65.58 18.06,29.49 16.42,27.85 DVCC.1
GND: length 1567.1
  Top Layer w0.127: NOREF.1 9.27,9.14 1.65,1.52 U27.40
  Top Layer w0.254: USB1.13 USB1.13 ; USB1.14 USB1.14
  Top Layer w0.381: U19.3 10.92,85.22 U19.9 12.19,82.68 13.2,82.68 ; USB1.13 14.04,90.12 USB1.1 ; USB1.14 4.6,95.68 SW6.6 ; 13.64,79.76 13.64,79.76 v1(12.59,79.76) ; 13.64,79.76 13.64,79.04 R30.2 ; 13.64,79.76 R29.1 ; v1(10.29,72.46) 10.78,72.95 11.67,72.95 12.75,74.03 14.22,74.03 14.58,74.4 14.58,75.72 v1(14.6,75.74) ; 258.37,82.18 264.37,82.18 266.64,79.92 266.64,63.66 264.42,61.44 258.2,61.44 257.47,62.17 257.47,62.28 249.46,62.28 248.62,61.44 239.18,61.44 238.42,62.2 238.42,62.28 230.41,62.28 229.57,61.44 220.13,61.44 219.37,62.2 219.37,62.28 211.36,62.28 210.52,61.44 201.08,61.44 200.32,62.2 200.32,62.28 192.31,62.28 191.47,61.44 182.03,61.44 181.27,62.2 181.27,62.28 173.26,62.28 172.42,61.44 162.98,61.44 162.22,62.2 162.22,62.28 154.22,62.28 153.37,61.44 143.93,61.44 143.17,62.2 143.17,62.28 135.16,62.28 134.32,61.44 124.88,61.44 124.12,62.2 124.12,62.28 116.12,62.28 115.27,61.44 105.83,61.44 105.07,62.2 105.07,62.28 97.06,62.28 96.22,61.44 86.78,61.44 86.02,62.2 86.02,62.28 78.02,62.28 77.17,61.44 67.73,61.44 66.97,62.2 66.97,62.28 58.97,62.28 58.12,61.44 48.68,61.44 47.92,62.2 47.92,62.28 39.92,62.28 39.07,61.44 29.63,61.44 28.87,62.2 28.87,62.28 ; USB1.13 14.92,94.63 24.88,94.63 26.21,93.3 26.21,83.77 27.07,82.92 29.14,82.92 29.77,82.29 LED78.3 37.77,82.21 38.61,83.06 48.06,83.06 48.82,82.29 LED77.3 56.82,82.21 57.66,83.06 67.11,83.06 67.87,82.29 LED76.3 75.87,82.21 76.71,83.06 86.16,83.06 86.92,82.29 LED75.3 94.92,82.21 95.76,83.06 105.21,83.06 105.97,82.29 LED74.3 113.97,82.21 114.81,83.06 124.26,83.06 125.02,82.29 LED73.3 133.02,82.21 133.86,83.06 143.31,83.06 144.07,82.29 144.07,82.21 152.07,82.21 152.91,83.06 162.36,83.06 163.12,82.29 LED71.3 171.12,82.21 171.96,83.06 181.41,83.06 182.17,82.29 LED70.3 190.17,82.21 191.01,83.06 200.46,83.06 201.22,82.29 LED69.3 209.22,82.21 210.06,83.06 219.51,83.06 220.27,82.29 LED68.3 228.27,82.21 229.11,83.06 238.56,83.06 239.32,82.29 LED67.3 247.32,82.21 248.16,83.06 257.61,83.06 258.37,82.29 LED66.3 ; LED1.3 258.37,6.09 257.61,6.86 248.16,6.86 247.32,6.01 LED2.3 239.32,6.09 238.56,6.86 229.11,6.86 228.27,6.01 LED3.3 220.27,6.09 219.51,6.86 210.06,6.86 209.22,6.01 LED4.3 201.22,6.09 200.46,6.86 191.01,6.86 190.17,6.01 LED5.3 182.17,6.09 181.41,6.86 171.96,6.86 171.12,6.01 LED6.3 163.12,6.09 162.36,6.86 152.91,6.86 152.07,6.01 144.07,6.01 144.07,6.09 143.31,6.86 133.86,6.86 133.02,6.01 LED8.3 125.02,6.09 124.26,6.86 114.81,6.86 113.97,6.01 LED9.3 105.97,6.09 105.21,6.86 95.76,6.86 94.92,6.01 LED10.3 86.92,6.09 86.16,6.86 76.71,6.86 75.87,6.01 LED11.3 67.87,6.09 67.11,6.86 57.66,6.86 56.82,6.01 LED12.3 48.82,6.09 48.06,6.86 38.61,6.86 37.77,6.01 LED13.3 29.77,6.18 29.37,6.58 24.03,6.58 22.98,7.63 22.98,8.71 23.26,9 23.3,9 23.3,8.99 24.37,8.99 25.13,9.75 25.13,10.82 24.37,11.58 23.33,11.58 22.98,11.94 22.98,14.08 23.25,14.35 25.09,14.35 26.21,15.47 26.21,17 25.05,18.17 22.99,18.17 22.84,18.31 22.84,23.93 23.12,24.21 LED14.3 28.87,24.13 29.63,23.37 39.07,23.37 39.92,24.21 LED15.3 47.92,24.13 48.68,23.37 58.12,23.37 58.97,24.21 66.97,24.21 66.97,24.13 67.73,23.37 77.17,23.37 78.02,24.21 LED17.3 86.02,24.13 86.78,23.37 96.22,23.37 97.07,24.21 LED18.3 105.07,24.13 105.83,23.37 115.27,23.37 116.12,24.21 LED19.3 124.12,24.13 124.88,23.37 134.32,23.37 135.17,24.21 LED20.3 143.17,24.13 143.93,23.37 153.37,23.37 154.22,24.21 LED21.3 162.22,24.13 162.98,23.37 172.42,23.37 173.27,24.21 LED22.3 181.27,24.13 182.03,23.37 191.47,23.37 192.32,24.21 LED23.3 200.32,24.13 201.08,23.37 210.52,23.37 211.37,24.21 LED24.3 219.37,24.13 220.13,23.37 229.57,23.37 230.42,24.21 238.42,24.21 238.42,24.13 239.18,23.37 248.62,23.37 249.47,24.21 LED26.3 257.47,24.09 258.2,23.37 264.42,23.37 266.64,25.59 266.64,41.84 264.38,44.11 LED27.3 258.37,44.19 257.61,44.96 248.16,44.96 247.32,44.11 LED28.3 239.32,44.19 238.56,44.96 229.11,44.96 228.27,44.11 LED29.3 220.27,44.19 219.51,44.96 210.06,44.96 209.22,44.11 LED30.3 201.22,44.19 200.46,44.96 191.01,44.96 190.17,44.11 LED31.3 182.17,44.19 181.41,44.96 171.96,44.96 171.12,44.11 LED32.3 163.12,44.19 162.36,44.96 152.91,44.96 152.07,44.11 144.07,44.11 144.07,44.19 143.31,44.96 133.86,44.96 133.02,44.11 LED34.3 125.02,44.19 124.26,44.96 114.81,44.96 113.97,44.11 LED35.3 105.97,44.19 105.21,44.96 95.76,44.96 94.92,44.11 LED36.3 86.92,44.19 86.16,44.96 76.71,44.96 75.87,44.11 LED37.3 67.87,44.19 67.11,44.96 57.66,44.96 56.82,44.11 LED38.3 48.82,44.19 48.06,44.96 38.61,44.96 37.77,44.11 LED39.3 29.77,44.28 29.37,44.68 24.03,44.68 22.98,45.73 22.98,46.81 23.26,47.1 23.3,47.1 23.3,47.09 24.37,47.09 25.13,47.85 25.13,48.92 24.37,49.68 23.33,49.68 22.98,50.04 22.98,52.18 23.25,52.45 25.09,52.45 26.21,53.57 26.21,55.1 25.05,56.27 22.99,56.27 22.84,56.41 22.84,62.03 23.12,62.31 LED53.3 ; USB1.14 6.54,90.12 USB1.12
  Bottom Layer w0.127: v1(18.92,1.52) 17.79,1.52 11.69,7.62
  Bottom Layer w0.254: 8.13,27.34 8.13,22.73 5.14,19.73 5.14,19.06 11.69,12.51 NOREF.1 ; 8.13,27.34 7.62,27.85 ; 8.13,27.34 DGND.1 8.13,29.95 16.19,29.95 17.23,30.99 17.23,65.18 17,65.4 11.69,65.4 7.88,69.21 5.47,69.21 4.41,70.27 4.41,80.34 5.12,81.05 5.12,82.37 4.1,83.38 ; USB1.13 13.68,95.25 D83.2 ; U30.1 U29.1 U28.1 11.43,95.25
  Bottom Layer w0.381: USB1.14 4.64,88.81 4.64,83.77 4.26,83.38 SW6.5 ; v1(13.72,82.68) 13.72,80.88 v1(12.59,79.76) U22.1 14.14,75.74 v1(14.6,75.74) ; v1(13.72,85.22) 14.61,86.11 14.61,90.12 USB1.13 ; U26.2 C13.2 6.27,2.57 C14.2 ; USB1.14 7.55,95.91 10.77,95.91 D83.2 ; C10.1 v1(10.29,72.46)
  Bottom Layer w0.508: C11.1 C10.1 C8.1
  Bottom Layer w0.889: NOREF.1 11.69,7.68 C13.2
VBUS: length 17
  Top Layer w0.381: USB1.11 7.89,90.15 8.09,90.36 8.09,91.27 8.38,91.57 9.24,91.57 9.26,91.58 9.79,91.58 9.81,91.57 v1(11.42,91.57) 12.19,91.57 12.45,91.31 12.45,90.39 12.69,90.15 USB1.2
  Bottom Layer w0.254: U28.2 11.43,92.46 11,92.88 8.76,92.88 8.66,92.98 8.66,93.88 9.15,94.36 D83.1
  Bottom Layer w0.381: v1(7.87,89.03) 7.87,87.3 D87.2
COL1: length 115.6
  Top Layer w0.127: U27.15 17.15,19.07 16.26,18.18 v1(16.26,15.11)
  Bottom Layer w0.127: 21.1,54.36 21.1,73.28 ; 21.1,54.36 26.01,54.36 SWCH27.2 ; 21.1,54.36 21.1,35.27 ; 21.1,73.28 21.1,92.44 21.19,92.53 25.94,92.53 SWCH1.2 ; 21.1,73.28 25.91,73.28 SWCH14.2 ; 21.1,35.27 26.01,35.27 26.03,35.29 ; 21.1,35.27 21.1,16.24 ; SWCH66.2 26.02,16.24 21.1,16.24 ; 21.1,16.24 21.1,12.58 20.45,11.94 19.43,11.94 v1(16.26,15.11)
COL2: length 148.2
  Top Layer w0.127: v1(16.26,14.34) 15.74,14.86 15.74,19.17 U27.16 ; v1(40.15,85.09) v1(40.15,84.05) ; v1(40.14,7.62) 40.14,16.23 v1(40.15,16.24) ; v1(40.15,46.99) v1(40.15,45.95) ; v1(40.15,27.94) v1(40.15,26.9) ; v1(40.15,66.04) v1(40.15,65)
  Bottom Layer w0.127: 40.15,54.36 45.06,54.36 45.08,54.35 ; 40.15,92.44 40.24,92.53 44.99,92.53 45.08,92.45 ; v1(40.15,27.94) v1(40.15,45.95) ; v1(40.15,26.9) v1(40.15,16.24) ; v1(40.15,46.99) v1(40.15,65) ; 40.15,73.28 44.96,73.28 45.08,73.4 ; v1(40.14,7.62) 35.4,2.88 22.92,2.88 19.19,6.62 19.19,11.42 v1(16.26,14.34) ; 40.15,92.44 v1(40.15,85.09) ; 45.08,35.3 45.06,35.28 40.15,35.28 ; v1(40.15,84.05) v1(40.15,66.04) ; 40.15,16.24 SWCH67.2 45.08,16.25
COL3: length 168.1
  Top Layer w0.127: v1(59.2,46.99) v1(59.2,45.95) ; U27.17 14.61,15.23 v1(16.26,13.58) ; v1(59.2,85.09) v1(59.2,84.05) ; v1(59.2,66.04) v1(59.2,65) ; v1(59.19,7.62) 59.19,16.23 v1(59.2,16.24) ; v1(59.2,27.94) v1(59.2,26.9)
  Bottom Layer w0.127: 59.2,54.36 64.11,54.36 64.13,54.35 ; v1(59.2,45.95) v1(59.2,27.94) ; 64.13,92.45 64.04,92.53 59.29,92.53 59.2,92.44 ; 64.13,73.4 64.01,73.28 59.2,73.28 ; v1(59.2,84.05) v1(59.2,66.04) ; v1(59.2,26.9) v1(59.2,16.24) ; v1(59.2,46.99) v1(59.2,65) ; 64.13,16.25 SWCH68.2 59.2,16.24 ; 59.2,35.28 64.11,35.28 64.13,35.3 ; v1(59.19,7.62) 54.22,2.65 22.83,2.65 20.81,4.67 20.8,4.67 18.96,6.51 18.96,10.89 v1(16.26,13.58) ; 59.2,92.44 v1(59.2,85.09)
COL4: length 188
  Top Layer w0.127: U27.18 13.34,15.77 16.26,12.85 v1(16.26,12.82) ; v1(78.25,66.04) v1(78.25,65) ; v1(78.25,27.94) v1(78.25,26.9) ; v1(78.24,7.62) 78.24,16.23 v1(78.25,16.24) ; v1(78.25,85.09) v1(78.25,84.05) ; v1(78.25,46.99) v1(78.25,45.95)
  Bottom Layer w0.127: 78.25,16.24 SWCH69.2 83.18,16.25 ; 78.25,92.44 v1(78.25,85.09) ; 83.18,92.45 83.09,92.53 78.34,92.53 78.25,92.44 ; 78.25,73.28 83.06,73.28 83.18,73.4 ; v1(78.25,27.94) v1(78.25,45.95) ; v1(78.25,66.04) v1(78.25,84.05) ; 78.25,35.28 83.16,35.28 83.18,35.3 ; v1(78.25,26.9) v1(78.25,16.24) ; 78.25,54.36 83.16,54.36 83.18,54.35 ; v1(16.26,12.82) 18.73,10.35 18.73,6.42 20.7,4.44 20.72,4.44 22.73,2.42 73.04,2.42 v1(78.24,7.62) ; v1(78.25,46.99) v1(78.25,65)
COL5: length 208
  Top Layer w0.127: U27.19 12.07,16.27 16.27,12.08 v1(16.27,12.06) ; v1(97.29,7.62) 97.29,16.23 v1(97.3,16.24) ; v1(97.3,46.99) v1(97.3,45.95) ; v1(97.3,27.94) v1(97.3,26.9) ; v1(97.3,66.04) v1(97.3,65) ; v1(97.3,85.09) v1(97.3,84.05)
  Bottom Layer w0.127: 102.23,16.25 SWCH70.2 97.3,16.24 ; 97.3,35.28 102.21,35.28 102.23,35.3 ; v1(16.27,12.06) 18.5,9.83 18.5,6.32 22.45,2.37 22.46,2.37 22.64,2.2 91.87,2.2 v1(97.29,7.62) ; v1(97.3,46.99) v1(97.3,65) ; v1(97.3,26.9) v1(97.3,16.24) ; 97.3,92.44 v1(97.3,85.09) ; v1(97.3,27.94) v1(97.3,45.95) ; 97.3,54.36 102.21,54.36 102.23,54.35 ; 97.3,92.44 97.39,92.53 102.14,92.53 102.23,92.45 ; 102.23,73.4 102.11,73.28 97.3,73.28 ; v1(97.3,66.04) v1(97.3,84.05)
COL6: length 222.9
  Top Layer w0.127: v1(116.35,27.94) v1(116.35,26.9) ; v1(116.35,16.24) 116.34,16.23 v1(116.34,7.62) ; 18.92,14.22 18.68,14.22 17.26,12.8 17.26,11.03 17.15,10.92 16.77,10.92 16.39,11.3 v1(16.25,11.3) ; v1(116.35,85.09) v1(116.35,84.05) ; v1(116.35,66.04) v1(116.35,65) ; v1(116.35,46.99) v1(116.35,45.95)
  Bottom Layer w0.127: 116.35,35.28 121.26,35.28 121.28,35.3 ; 116.35,73.28 121.16,73.28 121.28,73.4 ; 121.28,92.45 121.19,92.53 116.44,92.53 116.35,92.44 ; 116.35,92.44 v1(116.35,85.09) ; v1(116.35,66.04) v1(116.35,84.05) ; 121.28,54.35 121.26,54.36 116.35,54.36 ; v1(116.34,7.62) 116.21,7.62 110.56,1.97 22.53,1.97 18.27,6.23 18.27,9.28 v1(16.25,11.3) ; v1(116.35,26.9) v1(116.35,16.24) ; v1(116.35,46.99) v1(116.35,65) ; 116.35,16.24 SWCH71.2 121.28,16.25 ; v1(116.35,27.94) v1(116.35,45.95)
COL7: length 241.4
  Top Layer w0.127: v1(135.4,27.94) v1(135.4,26.9) ; v1(135.4,46.99) v1(135.4,45.95) ; v1(135.4,16.24) 135.39,16.23 v1(135.39,7.62) ; 18.92,12.95 18.68,12.95 17.49,11.76 17.49,10.12 17.4,10.03 16.75,10.03 v1(16.25,10.53) ; v1(135.4,66.04) v1(135.4,65) ; v1(135.4,85.09) v1(135.4,84.05)
  Bottom Layer w0.127: v1(135.4,26.9) v1(135.4,16.24) ; 135.4,73.28 140.21,73.28 140.33,73.4 ; 140.33,35.3 140.31,35.28 135.4,35.28 ; 140.33,16.25 SWCH72.2 135.4,16.24 ; v1(135.4,27.94) v1(135.4,45.95) ; 140.33,54.35 140.31,54.36 135.4,54.36 ; v1(16.25,10.53) 18.04,8.74 18.04,6.13 22.43,1.74 129.51,1.74 v1(135.39,7.62) ; 135.4,92.44 135.49,92.53 140.24,92.53 140.33,92.45 ; 135.4,92.44 v1(135.4,85.09) ; v1(135.4,46.99) v1(135.4,65) ; v1(135.4,66.04) v1(135.4,84.05)
COL8: length 259.9
  Top Layer w0.127: v1(16.25,9.77) 16.25,9.75 16.85,9.14 17.66,9.14 17.72,9.2 17.72,10.72 18.68,11.68 18.92,11.68 ; v1(154.45,66.04) v1(154.45,65) ; v1(154.45,16.24) 154.44,16.23 v1(154.44,7.62) ; v1(154.45,27.94) v1(154.45,26.9) ; v1(154.45,46.99) v1(154.45,45.95) ; v1(154.45,85.09) v1(154.45,84.05)
  Bottom Layer w0.127: 159.38,73.4 159.26,73.28 154.45,73.28 ; v1(154.45,27.94) v1(154.45,45.95) ; 159.38,35.3 159.36,35.28 154.45,35.28 ; v1(154.45,46.99) v1(154.45,65) ; v1(16.25,9.77) 16.25,9.75 17.71,8.28 17.71,6.14 22.34,1.51 129.6,1.51 129.86,1.76 148.07,1.76 153.93,7.62 v1(154.44,7.62) ; 159.38,16.25 SWCH73.2 154.45,16.24 ; 154.45,92.44 v1(154.45,85.09) ; v1(154.45,66.04) v1(154.45,84.05) ; 159.38,54.35 159.36,54.36 154.45,54.36 ; 159.38,92.45 159.29,92.53 154.54,92.53 154.45,92.44 ; v1(154.45,26.9) v1(154.45,16.24)
COL9: length 277.8
  Top Layer w0.127: v1(173.5,27.94) v1(173.5,26.9) ; v1(173.5,85.09) v1(173.5,84.05) ; v1(173.5,66.04) v1(173.5,65) ; v1(173.49,7.62) 173.49,16.23 v1(173.5,16.24) ; v1(16.25,9.01) 16.75,8.51 17.35,8.51 17.95,9.11 17.95,9.68 18.8,10.52 18.92,10.41 ; v1(173.5,46.99) v1(173.5,45.95)
  Bottom Layer w0.127: 173.5,92.44 v1(173.5,85.09) ; 178.43,73.4 178.31,73.28 173.5,73.28 ; v1(173.5,46.99) v1(173.5,65) ; 178.43,16.25 SWCH74.2 173.5,16.24 ; 173.5,35.28 178.41,35.28 178.43,35.3 ; 173.5,92.44 173.59,92.53 178.34,92.53 178.43,92.45 ; v1(173.5,66.04) v1(173.5,84.05) ; v1(173.49,7.62) 167.15,1.28 22.24,1.28 17.48,6.04 17.48,7.75 16.25,8.98 v1(16.25,9.01) ; v1(173.5,26.9) v1(173.5,16.24) ; v1(173.5,27.94) v1(173.5,45.95) ; 173.5,54.36 178.41,54.36 178.43,54.35
COL10: length 295.7
  Top Layer w0.127: v1(192.55,46.99) v1(192.55,45.95) ; 18.92,9.14 18.68,9.14 17.42,7.87 16.64,7.87 16.26,8.26 v1(16.25,8.25) ; v1(192.55,85.09) v1(192.55,84.05) ; v1(192.55,16.24) 192.54,16.23 v1(192.54,7.62) ; v1(192.55,66.04) v1(192.55,65) ; v1(192.55,27.94) v1(192.55,26.9)
  Bottom Layer w0.127: v1(192.55,45.95) v1(192.55,27.94) ; 192.55,73.28 197.36,73.28 197.48,73.4 ; 192.55,16.24 SWCH75.2 197.48,16.25 ; 197.48,54.35 197.46,54.36 192.55,54.36 ; 192.55,92.44 v1(192.55,85.09) ; v1(192.55,66.04) v1(192.55,84.05) ; 197.48,92.45 197.39,92.53 192.64,92.53 192.55,92.44 ; 192.55,35.28 197.46,35.28 197.48,35.3 ; v1(16.25,8.25) 17.25,7.24 17.25,5.95 22.15,1.05 185.97,1.05 v1(192.54,7.62) ; v1(192.55,26.9) v1(192.55,16.24) ; v1(192.55,46.99) v1(192.55,65)
COL11: length 314.6
  Top Layer w0.127: v1(211.6,46.99) v1(211.6,45.95) ; v1(211.6,85.09) v1(211.6,84.05) ; 18.92,7.87 18.79,7.74 18.56,7.74 17.8,6.98 16.75,6.98 v1(16.25,7.49) ; v1(211.59,7.62) 211.59,16.23 v1(211.6,16.24) ; v1(211.6,66.04) v1(211.6,65) ; v1(211.6,27.94) v1(211.6,26.9)
  Bottom Layer w0.127: 211.6,16.24 SWCH76.2 216.53,16.25 ; 211.6,92.44 v1(211.6,85.09) ; 211.6,35.28 216.51,35.28 216.53,35.3 ; v1(211.59,7.62) 211.59,7.11 205.3,0.82 22.05,0.82 17.02,5.85 17.02,6.68 16.38,7.33 16.38,7.36 v1(16.25,7.49) ; v1(211.6,84.05) v1(211.6,66.04) ; v1(211.6,46.99) v1(211.6,65) ; 216.53,54.35 216.51,54.36 211.6,54.36 ; 216.53,92.45 216.44,92.53 211.69,92.53 211.6,92.44 ; v1(211.6,26.9) v1(211.6,16.24) ; v1(211.6,45.95) v1(211.6,27.94) ; 216.53,73.4 216.41,73.28 211.6,73.28
COL12: length 333
  Top Layer w0.127: v1(230.64,7.62) 230.64,16.23 v1(230.65,16.24) ; 18.92,6.6 18.54,6.6 17.79,5.84 17.13,5.84 v1(16.25,6.72) ; v1(230.65,66.04) v1(230.65,65) ; v1(230.65,27.94) v1(230.65,26.9) ; v1(230.65,46.99) v1(230.65,45.95) ; v1(230.65,85.09) v1(230.65,84.05)
  Bottom Layer w0.127: 235.58,73.4 235.46,73.28 230.65,73.28 ; 230.65,92.44 230.74,92.53 235.49,92.53 235.58,92.45 ; 230.65,35.28 235.56,35.28 235.58,35.3 ; 235.58,54.35 235.56,54.36 230.65,54.36 ; v1(230.65,27.94) v1(230.65,45.95) ; 230.65,16.24 SWCH77.2 235.58,16.25 ; v1(230.64,7.62) 223.61,0.59 21.96,0.59 16.77,5.78 16.77,6.18 16.25,6.7 v1(16.25,6.72) ; v1(230.65,26.9) v1(230.65,16.24) ; 230.65,92.44 v1(230.65,85.09) ; v1(230.65,46.99) v1(230.65,65) ; v1(230.65,66.04) v1(230.65,84.05)
COL13: length 351.7
  Top Layer w0.127: v1(249.7,85.09) v1(249.7,84.05) ; v1(249.69,7.62) 249.69,16.23 v1(249.7,16.24) ; v1(249.7,66.04) v1(249.7,65) ; v1(16.25,5.96) 17.39,4.82 18.17,4.82 18.67,5.33 18.92,5.33 ; v1(249.7,27.94) v1(249.7,26.9) ; v1(249.7,46.99) v1(249.7,45.95)
  Bottom Layer w0.127: 254.63,73.4 254.51,73.28 249.7,73.28 ; 249.7,35.28 254.61,35.28 254.63,35.3 ; v1(249.7,46.99) v1(249.7,65) ; 249.7,16.24 SWCH78.2 254.63,16.25 ; 249.7,92.44 v1(249.7,85.09) ; v1(249.69,7.62) 242.43,0.36 21.86,0.36 16.27,5.96 v1(16.25,5.96) ; v1(249.7,26.9) v1(249.7,16.24) ; v1(249.7,66.04) v1(249.7,84.05) ; 254.63,92.45 254.54,92.53 249.79,92.53 249.7,92.44 ; 254.63,54.35 254.61,54.36 249.7,54.36 ; v1(249.7,45.95) v1(249.7,27.94)
D+: length 101.8
  Top Layer w0.254: 9.54,90.92 USB1.8 ; 9.54,90.92 9.55,90.93 10.16,90.93 10.54,90.55 USB1.6 ; 9.54,90.92 v1(9.52,90.93)
  Top Layer w0.381: v1(8.64,18.03) v1(2.93,18.03) ; 18.92,18.03 v1(16.9,18.03)
  Bottom Layer w0.254: v1(2.93,18.03) 2.8,18.03 2.15,18.67 2.15,75.7 1.66,76.2 1.66,77.94 0.84,78.75 0.84,83.65 0.91,83.71 0.91,83.75 1.42,84.26 3.12,84.26 4.07,85.21 4.07,89.85 5.62,91.4 8.71,91.4 9.14,91.83 U30.2 9.52,91.58 v1(9.52,90.93)
  Bottom Layer w0.381: v1(16.9,18.03) v1(8.64,18.03)
D-: length 108.6
  Top Layer w0.254: v1(7.75,92.33) 7.78,92.3 v1(10.29,92.3) ; v1(2.93,91.95) 0.77,89.79 v1(0.77,85.47) ; USB1.5 10.97,89.5 10.97,88.78 10.69,88.5 10.6,88.5 v1(10.54,88.57) 10.31,88.57 10.04,88.84 USB1.7
  Top Layer w0.381: 18.92,16.76 v1(16.9,16.76) ; v1(8.64,16.76) v1(2.93,16.76)
  Bottom Layer w0.127: v1(9.02,88.4) 10.38,88.4 v1(10.54,88.57)
  Bottom Layer w0.254: v1(10.54,88.57) 10.55,88.57 10.55,91.05 10.29,91.31 U29.2 ; v1(7.75,92.33) 7.37,91.95 v1(2.93,91.95) ; v1(2.93,16.76) 2.93,17.01 1.92,18.01 1.92,18.4 1.79,18.53 1.79,75.44 1.67,75.56 1.67,75.68 0.49,76.86 0.49,83.92 0.77,84.2 v1(0.77,85.47)
  Bottom Layer w0.381: v1(16.9,16.76) v1(8.64,16.76)
DISP: length 13.2
  Top Layer w0.762: 10.16,27.34 10.16,23.11 8.39,21.33 4.52,21.33 3.18,19.99 U27.26
EN: length 158.3
  Top Layer w0.381: SW6.4 3.93,83.89 v1(3.93,82.67) ; v1(15.3,2.42) 16.27,2.42 17.91,4.06 18.92,4.06 ; 18.92,15.49 18.91,15.49 v1(17.4,15.49)
  Bottom Layer w0.381: SW6.4 1.18,86.64 1.18,92.43 SW6.1 ; v1(17.4,15.49) 16.79,15.49 16.53,15.75 15.99,15.75 15.6,15.36 15.6,5.69 19.13,2.16 19.3,2.16 19.56,1.9 19.56,1.25 19.18,0.87 18.65,0.87 18.36,1.16 17.64,1.16 16.39,2.41 R32.2 13.9,2.24 12.42,0.76 5.97,0.76 5.95,0.78 4.71,0.78 4.22,1.28 4.22,17.76 2.63,19.35 2.63,30.94 3.82,32.12 15.55,32.12 15.68,32.26 15.68,64.84 15.63,64.89 11.6,64.89 7.71,68.79 5.29,68.79 3.99,70.1 3.99,74.88 2.29,76.58 2.29,78.12 1.56,78.85 1.56,79.67 3.93,82.04 v1(3.93,82.67)
LED: length 79.8
  Top Layer w0.381: v1(22.1,82.29) 20.83,82.29 19.05,80.52 19.05,21.21 18.29,20.44 5.05,20.44 4.45,19.85 U27.25
  Bottom Layer w0.381: R35.1 22.09,82.28 v1(22.1,82.29)
LEDVCC: length 1337
  Top Layer w0.381: 28.92,43.18 28.92,42.82 29.3,42.44 38.66,42.44 39.46,43.24 47.97,43.24 ; 28.92,43.18 28.92,43.24 ; 28.92,43.18 23.25,43.18 21.47,44.96 21.47,62.61 22.74,63.88 29.09,63.88 29.72,63.25 LED53.2 ; LED65.2 258.32,63.56 257.94,63.93 248.57,63.93 247.78,63.14 239.27,63.14 ; LED65.2 263.7,63.16 264.93,64.39 264.93,78.99 263.53,80.39 257.95,80.39 257.52,80.82 LED66.2 257.47,81.31 249.11,81.31 248.31,80.51 238.95,80.51 238.57,80.89 238.57,81.31 ; LED65.2 258.32,63.14 ; 239.27,25.09 239.27,25.51 238.89,25.88 229.52,25.88 228.73,25.09 220.22,25.09 220.22,25.51 219.84,25.88 210.47,25.88 209.68,25.09 201.17,25.09 201.17,25.51 200.79,25.88 191.42,25.88 190.63,25.09 182.12,25.09 182.12,25.51 181.74,25.88 172.38,25.88 171.58,25.09 163.07,25.09 ; 238.52,43.19 230.01,43.19 229.21,42.39 219.85,42.39 219.47,42.77 219.47,43.19 210.96,43.19 210.16,42.39 200.8,42.39 200.42,42.77 200.42,43.19 191.91,43.19 191.11,42.39 181.75,42.39 181.37,42.77 181.37,43.19 172.86,43.19 172.06,42.39 162.7,42.39 162.32,42.77 162.32,43.19 ; 238.57,5.09 238.57,4.67 238.95,4.29 248.31,4.29 249.11,5.09 257.47,5.09 257.52,5.14 ; 124.22,43.21 124.22,42.79 124.6,42.41 133.96,42.41 134.76,43.21 143.27,43.21 143.27,42.79 143.65,42.41 153.01,42.41 153.81,43.21 162.32,43.21 ; 162.32,81.31 162.32,80.89 162.7,80.51 172.06,80.51 172.86,81.31 181.37,81.31 181.37,80.89 181.75,80.51 191.11,80.51 191.91,81.31 200.42,81.31 200.42,80.89 200.8,80.51 210.16,80.51 210.96,81.31 219.47,81.31 219.47,80.89 219.85,80.51 229.21,80.51 230.01,81.31 238.52,81.31 ; 163.02,63.16 163.02,63.58 162.64,63.96 153.27,63.96 152.48,63.16 143.97,63.16 143.97,63.58 143.59,63.96 134.22,63.96 133.43,63.16 124.92,63.16 ; 124.92,25.11 124.92,25.53 124.54,25.91 115.17,25.91 114.38,25.11 105.87,25.11 105.87,25.53 105.49,25.91 96.12,25.91 95.33,25.11 86.82,25.11 86.82,25.53 86.44,25.91 77.08,25.91 76.28,25.11 67.77,25.11 67.77,25.53 67.39,25.91 58.03,25.91 57.23,25.11 48.72,25.11 ; 47.97,5.14 39.46,5.14 38.66,4.34 29.3,4.34 28.92,4.72 28.92,5.14 ; 47.97,5.11 47.97,4.69 48.35,4.31 57.71,4.31 58.51,5.11 67.02,5.11 67.02,4.69 67.4,4.31 76.76,4.31 77.56,5.11 86.07,5.11 86.07,4.69 86.45,4.31 95.81,4.31 96.61,5.11 105.12,5.11 105.12,4.69 105.5,4.31 114.86,4.31 115.66,5.11 124.17,5.11 ; 124.92,63.18 124.92,63.61 124.54,63.98 115.18,63.98 114.38,63.18 105.87,63.18 105.87,63.61 105.49,63.98 96.13,63.98 95.33,63.19 86.82,63.19 86.82,63.61 86.44,63.98 77.08,63.98 76.28,63.19 67.77,63.19 67.77,63.61 67.39,63.98 58.03,63.98 57.23,63.19 48.72,63.19 ; 29.72,25.09 29.72,25.17 29.09,25.8 22.74,25.8 21.47,24.53 21.47,6.88 23.25,5.1 28.92,5.1 ; v1(22.1,84.33) 24.14,84.33 27.1,81.36 LED78.2 28.92,80.94 29.3,80.56 38.66,80.56 39.46,81.36 47.97,81.36 ; 162.32,5.09 162.32,4.67 162.7,4.29 172.06,4.29 172.86,5.09 181.37,5.09 181.37,4.67 181.75,4.29 191.11,4.29 191.91,5.09 200.42,5.09 200.42,4.67 200.8,4.29 210.16,4.29 210.96,5.09 219.47,5.09 219.47,4.67 219.85,4.29 229.21,4.29 230.01,5.09 238.52,5.09 ; 47.97,43.21 47.97,42.79 48.35,42.41 57.71,42.41 58.51,43.21 67.02,43.21 67.02,42.79 67.4,42.41 76.76,42.41 77.56,43.21 86.07,43.21 86.07,42.79 86.45,42.41 95.81,42.41 96.61,43.21 105.12,43.21 105.12,42.79 105.5,42.41 114.86,42.41 115.66,43.21 124.17,43.21 ; 47.97,81.34 47.97,80.92 48.35,80.54 57.71,80.54 58.51,81.34 67.02,81.34 67.02,80.92 67.4,80.54 76.76,80.54 77.56,81.34 86.07,81.34 86.07,80.92 86.45,80.54 95.81,80.54 96.61,81.34 105.12,81.34 105.12,80.92 105.5,80.54 114.86,80.54 115.66,81.34 124.17,81.34 ; 258.32,25.06 258.32,25.48 257.94,25.86 248.57,25.86 247.78,25.06 LED25.2 ; 124.22,5.11 124.22,4.69 124.6,4.31 133.96,4.31 134.76,5.11 143.27,5.11 143.27,4.69 143.65,4.31 153.01,4.31 153.81,5.11 162.32,5.11 ; 48.67,25.11 48.67,25.53 48.29,25.91 38.92,25.91 38.13,25.11 29.77,25.11 LED14.2 ; 29.72,63.14 29.77,63.18 38.13,63.18 38.93,63.98 48.29,63.98 48.67,63.61 48.67,63.18 ; LED64.2 239.27,63.58 238.89,63.96 229.52,63.96 228.73,63.16 LED63.2 220.22,63.58 219.84,63.96 210.47,63.96 209.68,63.16 LED62.2 201.17,63.58 200.79,63.96 191.42,63.96 190.63,63.16 LED61.2 182.12,63.58 181.74,63.96 172.38,63.96 171.58,63.16 163.07,63.16 ; 238.57,43.19 238.57,42.77 238.95,42.39 248.31,42.39 249.11,43.19 257.47,43.19 257.52,43.24 257.52,42.7 257.95,42.26 263.53,42.26 264.93,40.87 264.93,26.26 263.7,25.04 258.32,25.04 ; 124.22,81.34 124.22,80.92 124.6,80.54 133.96,80.54 134.76,81.34 143.27,81.34 143.27,80.92 143.65,80.54 153.01,80.54 153.81,81.34 162.32,81.34 ; 124.92,25.09 133.43,25.09 134.22,25.88 143.59,25.88 143.97,25.51 143.97,25.09 152.48,25.09 153.27,25.88 162.64,25.88 163.02,25.51 163.02,25.09
  Bottom Layer w0.381: v1(22.1,84.33) 22.1,83.23 R34.1
ROW1: length 347.3
  Top Layer w0.127: v1(22.1,80.01) v1(19.82,80.01)
  Bottom Layer w0.127: 114.81,84.57 114.81,84.58 D5.1 ; 114.81,84.57 111.3,84.57 110.25,85.63 107.39,85.63 106.33,84.57 95.75,84.57 ; 114.81,84.57 125.38,84.57 126.44,85.63 129.3,85.63 130.35,84.57 133.86,84.57 ; 95.75,84.57 92.25,84.57 91.2,85.63 88.34,85.63 87.28,84.57 76.71,84.57 ; 95.75,84.57 95.76,84.58 D4.1 ; 171.96,84.57 171.96,84.57 D8.1 ; 171.96,84.57 182.53,84.57 183.59,85.63 186.45,85.63 187.5,84.57 201.58,84.57 202.64,85.63 205.5,85.63 206.55,84.57 210.03,84.57 ; 171.96,84.57 168.45,84.57 167.4,85.63 164.54,85.63 163.48,84.57 152.91,84.57 ; 133.86,84.57 144.43,84.57 145.49,85.63 148.35,85.63 149.4,84.57 152.91,84.57 ; 133.86,84.57 133.86,84.57 D6.1 ; D2.1 57.66,84.57 ; 57.66,84.57 68.23,84.57 69.29,85.63 72.15,85.63 73.2,84.57 76.71,84.57 ; 57.66,84.57 54.15,84.57 53.1,85.63 50.24,85.63 49.18,84.57 38.59,84.57 ; D7.1 152.91,84.57 ; D11.1 229.11,84.57 229.11,84.57 ; D3.1 76.71,84.57 ; D10.1 210.06,84.6 210.03,84.57 ; v1(19.82,80.01) 18.84,79.03 18.84,21.45 18.26,20.88 7.29,20.88 v1(5.72,19.31) ; 38.59,84.57 35.1,84.57 34.05,85.63 32.64,85.63 27.03,80.01 v1(22.1,80.01) ; 38.59,84.57 38.61,84.59 D1.1 ; 248.14,84.57 244.65,84.57 243.6,85.63 240.74,85.63 239.68,84.57 229.11,84.57 ; 248.14,84.57 258.73,84.57 259.79,85.63 261.24,85.63 262.29,84.58 267.09,84.58 267.18,84.67 267.18,85.59 D13.1 ; 248.14,84.57 248.16,84.59 D12.1 ; 229.11,84.57 225.6,84.57 224.55,85.63 221.69,85.63 220.63,84.57 210.03,84.57 ; D9.1 191.01,84.57
ROW2: length 332.8
  Top Layer w0.127: v1(19.82,66.55) v1(22.1,66.55)
  Bottom Layer w0.127: 171.96,65.52 182.53,65.52 183.59,66.58 186.45,66.58 187.5,65.52 201.58,65.52 202.64,66.58 205.5,66.58 206.55,65.52 210.03,65.52 ; 171.96,65.52 171.96,65.52 D21.1 ; 171.96,65.52 168.45,65.52 167.4,66.58 164.54,66.58 163.48,65.52 152.91,65.52 ; 114.81,65.52 111.3,65.52 110.25,66.58 107.39,66.58 106.33,65.52 95.75,65.52 ; 114.81,65.52 114.81,65.53 D18.1 ; 114.81,65.52 125.38,65.52 126.44,66.58 129.3,66.58 130.35,65.52 133.86,65.52 ; D16.1 76.71,65.52 ; 76.71,65.52 73.2,65.52 72.15,66.58 69.29,66.58 68.23,65.52 57.66,65.52 ; 76.71,65.52 87.28,65.52 88.34,66.58 91.2,66.58 92.25,65.52 95.75,65.52 ; 57.66,65.52 54.15,65.52 53.1,66.58 50.24,66.58 49.18,65.52 38.59,65.52 ; 57.66,65.52 D15.1 ; v1(22.1,66.55) 23.08,66.55 24.1,65.52 30.13,65.52 31.19,66.58 32.64,66.58 ; 152.91,65.52 D20.1 ; 152.91,65.52 149.4,65.52 148.35,66.58 145.49,66.58 144.43,65.52 133.86,65.52 ; 229.11,65.52 225.6,65.52 224.55,66.58 221.69,66.58 220.63,65.52 210.03,65.52 ; 229.11,65.52 239.68,65.52 240.74,66.58 243.6,66.58 244.65,65.52 248.14,65.52 ; 229.11,65.52 229.11,65.52 D24.1 ; 133.86,65.52 133.86,65.52 D19.1 ; D14.1 38.61,65.54 38.59,65.52 ; D22.1 191.01,65.52 ; 95.75,65.52 95.76,65.53 D17.1 ; 38.59,65.52 35.1,65.52 34.05,66.58 32.64,66.58 ; 248.14,65.52 248.16,65.54 D25.1 ; 248.14,65.52 258.73,65.52 259.79,66.58 261.24,66.58 262.29,65.53 267.09,65.53 267.18,65.62 267.18,66.54 D26.1 ; 32.64,66.58 32.61,66.55 31.15,66.55 ; 210.03,65.52 210.06,65.55 D23.1 ; v1(19.82,66.55) 19.07,65.8 19.07,21.33 18.38,20.65 8.33,20.65 v1(6.99,19.31)
